# EAGLE design Funktionsgenerator Controller (EAGLE 9.0.0)
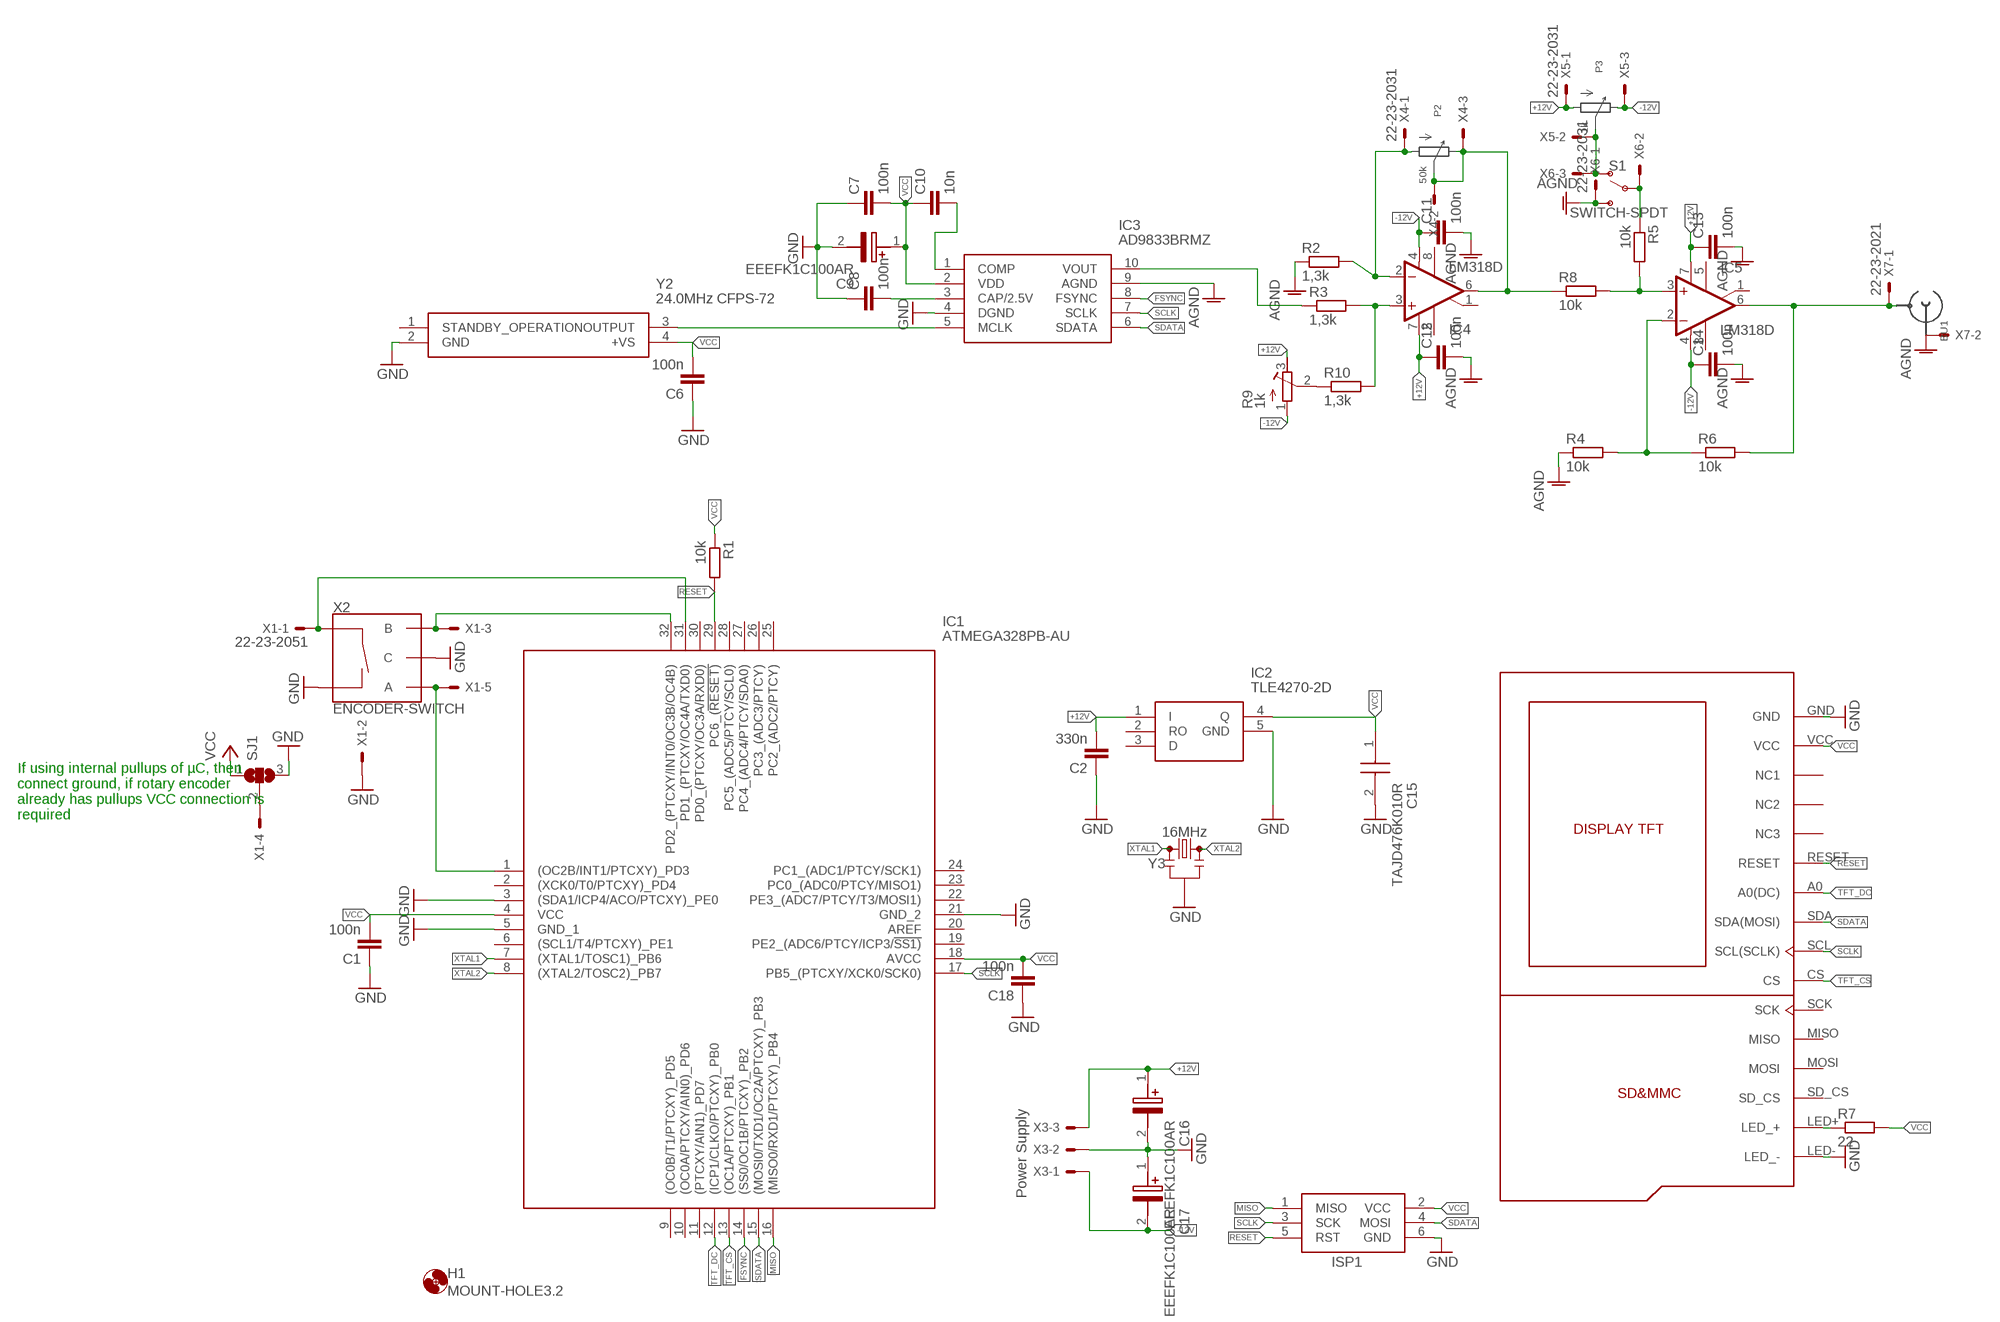
[diagram p0: schematic, sheet 1]

## Parts
C1  100n  C-EUC0603  [C0603]
C2  330n  C-EUC0603  [C0603]
C6  100n  C-EUC0603  [C0603]
C7  100n  C-EUC0603  [C0603]
C8  100n  C-EUC0603  [C0603]
C9  EEEFK1C100AR  [FKV(B)]
C10  10n  C-EUC0603  [C0603]
C11  100n  C-EUC0603  [C0603]
C12  100n  C-EUC0603  [C0603]
C13  100n  C-EUC0603  [C0603]
C14  100n  C-EUC0603  [C0603]
C15  TAJD476K010R  [CAPPM7344X310N]
C16  EEEFK1C100AR  [FKV(B)]
C17  EEEFK1C100AR  [FKV(B)]
C18  100n  C-EUC0603  [C0603]
H1  MOUNT-HOLE3.2  [3,2]
IC1  ATMEGA328PB-AU  [QFP80P900X900X120-32N]
IC2  TLE4270-2D  [PG-TO252-5-11]
IC3  AD9833BRMZ  [SOP50P490X110-10N]
IC4  LM318D  [SO08]
IC5  LM318D  [SO08]
ISP1  AVRISP-6  [AVRISP]
P1  DISPLAY_TFT_1,8  [DISPLAY_TFT_1,8-KMR]
R1  10k  R-EU_R0603  [R0603]
R2  1,3k  R-EU_R0603  [R0603]
R3  1,3k  R-EU_R0603  [R0603]
R4  10k  R-EU_R0603  [R0603]
R5  10k  R-EU_R0603  [R0603]
R6  10k  R-EU_R0603  [R0603]
R7  22  R-EU_R0603  [R0603]
R8  10k  R-EU_R0603  [R0603]
R9  1k  EVM3ESX50B  [EVM3ESX50B]
R10  1,3k  R-EU_R0603  [R0603]
S1  SWITCH-SPDT  (no package)
SJ1  SJ2W  [SJ_2]
X1  22-23-2051  [22-23-2051]
X2  ENCODER-SWITCH  (no package)
X3  Power Supply  22-23-2031  [22-23-2031]
X4  22-23-2031  [22-23-2031]
X5  22-23-2031  [22-23-2031]
X6  22-23-2031  [22-23-2031]
X7  22-23-2021  [22-23-2021]
Y2  24.0MHz CFPS-72  4.0MHZ_CFPS-72_50PPM_-40+85C_5  [CFPS-72]
Y3  16MHz  RESONATOR-16MHZSMD_3.2X1.3  [RESONATOR-SMD-3.2X1.3]

## Nets
+12V: C2.2 C12.1 C13.1 C16.1(+) IC2.1(I) IC4.7(V+) IC5.7(V+) R9.3(E) X3.3 X5.1
-12V: C11.1 C14.1 C17.2(-) IC4.4(V-) IC5.4(V-) R9.1(A) X3.1 X5.3
AGND: C11.2 C12.2 C13.2 C14.2 IC3.9(AGND) R2.1 R4.1 S1.S X6.1 X7.2
FSYNC: IC1.14((SS0/OC1B/PTCXY)_PB2) IC3.8(FSYNC)
GND: C1.1 C2.1 C6.1 C7.1 C8.1 C9.2(-) C15.2(-) C16.2(-) C17.1(+) C18.1 IC1.3((SDA1/ICP4/ACO/PTCXY)_PE0) IC1.5(GND_1) IC1.21(GND_2) IC2.5(GND) IC3.4(DGND) ISP1.6(GND) P1.GND P1.LED-(LED_-) SJ1.3 X1.2 X2.C X2.SW- X3.2 Y2.2(GND) Y3.2
MISO: IC1.16((MISO0/RXD1/PTCXY)_PB4) ISP1.1(MISO)
N$1: IC3.5(MCLK) Y2.3(OUTPUT)
N$2: C8.2 IC3.3(CAP/2.5V)
N$3: IC4.3(+IN) R3.2 R10.2
N$4: C10.2 IC3.1(COMP)
N$5: IC3.10(VOUT) R3.1
N$6: IC4.2(-IN) R2.2 X4.1
N$7: R5.1 S1.P X6.2
N$8: S1.O X5.2 X6.3
N$9: IC4.6(OUT) R8.1 X4.2 X4.3
N$10: IC5.6(OUT) R6.2 X7.1
N$11: IC5.2(-IN) R4.2 R6.1
N$12: SJ1.2 X1.4
N$13: IC5.3(+IN) R5.2 R8.2
N$14: R9.2(S) R10.1
N$18: P1.LED+(LED_+) R7.1
RESET: IC1.29(PC6_(!RESET)) ISP1.5(RST) P1.RESET R1.2
ROT_A: IC1.1((OC2B/INT1/PTCXY)_PD3) X1.5 X2.A
ROT_B: IC1.32(PD2_(PTCXY/INT0/OC3B/OC4B)) X1.3 X2.B
ROT_BTN: IC1.31(PD1_(PTCXY/OC4A/TXD0)) X1.1 X2.SW+
SCLK: IC1.17(PB5_(PTCXY/XCK0/SCK0)) IC3.7(SCLK) ISP1.3(SCK) P1.SCL(SCL(SCLK))
SDATA: IC1.15((MOSI0/TXD1/OC2A/PTCXY)_PB3) IC3.6(SDATA) ISP1.4(MOSI) P1.SDA(SDA(MOSI))
TFT_CS: IC1.13((OC1A/PTCXY)_PB1) P1.CS
TFT_DC: IC1.12((ICP1/CLKO/PTCXY)_PB0) P1.A0(A0(DC))
VCC: C1.2 C6.2 C7.2 C9.1(+) C10.1 C15.1(+) C18.2 IC1.4(VCC) IC1.18(AVCC) IC2.4(Q) IC3.2(VDD) ISP1.2(VCC) P1.VCC R1.1 R7.2 SJ1.1 Y2.4(+VS)
XTAL1: IC1.7((XTAL1/TOSC1)_PB6) Y3.1
XTAL2: IC1.8((XTAL2/TOSC2)_PB7) Y3.3
Unconnected: IC1.2((XCK0/T0/PTCXY)_PD4) IC1.6((SCL1/T4/PTCXY)_PE1) IC1.9((OC0B/T1/PTCXY)_PD5) IC1.10((OC0A/PTCXY/AIN0)_PD6) IC1.11((PTCXY/AIN1)_PD7) IC1.19(PE2_(ADC6/PTCY/ICP3/!SS1)) IC1.20(AREF) IC1.22(PE3_(ADC7/PTCY/T3/MOSI1)) IC1.23(PC0_(ADC0/PTCY/MISO1)) IC1.24(PC1_(ADC1/PTCY/SCK1)) IC1.25(PC2_(ADC2/PTCY)) IC1.26(PC3_(ADC3/PTCY)) IC1.27(PC4_(ADC4/PTCY/SDA0)) IC1.28(PC5_(ADC5/PTCY/SCL0)) IC1.30(PD0_(PTCXY/OC3A/RXD0)) IC2.2(RO) IC2.3(D) IC4.1(ON/CMP) IC4.5(ON) IC4.8(CMP) IC5.1(ON/CMP) IC5.5(ON) IC5.8(CMP) P1.MISO P1.MOSI P1.NC1 P1.NC2 P1.NC3 P1.SCK P1.SD_CS Y2.1(STANDBY_OPERATION)

## Notes on the sheet
- If using internal pullups of µC, then
  connect ground, if rotary encoder
  already has pullups VCC connection is
  required

## Library data of the parts
C1 C2 C6-C8 C10-C14 C18 = resistor:C-EU: CAPACITOR, European symbol
C9 C16 C17 = SamacSys_Parts:EEEFK1C100AR: Panasonic 10F 20% 1.35 16 V dc SMD Cylindrical Aluminium Electrolytic Capacitor Source: Datasheet <https://industrial.panasonic.com/cdbs/www-data/pdf/RDE0000/ABA0000C1175.pdf>; ALLIED_NUMBER: 70256491; ALLIED_PRICE/STOCK: https://www.alliedelec.com/panasonic-eee-fk1c100ar/70256491/; ARROW_PART_NUMBER: EEEFK1C100AR; ARROW_PRICE/STOCK: http://uk.rs-online.com/web/p/products/0565572; DESCRIPTION: Panasonic 10F 20% 1.35 16 V dc SMD Cylindrical Aluminium Electrolytic Capacitor; HEIGHT: mm; MANUFACTURER_NAME: Panasonic; MANUFACTURER_PART_NUMBER: EEEFK1C100AR; RS_PART_NUMBER: 0565572; RS_PRICE/STOCK: http://uk.rs-online.com/web/p/products/0565572
C15 = SamacSys_Parts:TAJD476K010R: AVX 47F SMD Solid MnO2 Tantalum Electrolytic Capacitor, 10 V dc 10%, TAJ Series Source: Datasheet <http://www.farnell.com/datasheets/1680476.pdf>; ALLIED_NUMBER: 70475107; ALLIED_PRICE/STOCK: https://www.alliedelec.com/avx-tajd476k010r/70475107/; ARROW_PART_NUMBER: TAJD476K010R; ARROW_PRICE/STOCK: http://uk.rs-online.com/web/p/products/4648224; DESCRIPTION: AVX 47F SMD Solid MnO2 Tantalum Electrolytic Capacitor, 10 V dc 10%, TAJ Series; HEIGHT: 3.1mm; MANUFACTURER_NAME: AVX; MANUFACTURER_PART_NUMBER: TAJD476K010R; RS_PART_NUMBER: 4648224; RS_PRICE/STOCK: http://uk.rs-online.com/web/p/products/4648224
H1 = holes:MOUNT-HOLE: MOUNTING HOLE with drill center marker
IC1 = SamacSys_Parts:ATMEGA328PB-AU: ATMEL - ATMEGA328PB-AU - MCU, 8BIT, ATMEGA, 20MHZ, TQFP-32 Source: Datasheet <http://www.farnell.com/datasheets/2014286.pdf>; ARROW_PART_NUMBER: ATMEGA328PB-AU; ARROW_PRICE/STOCK: https://www.arrow.com/en/products/atmega328pb-au/microchip-technology; DESCRIPTION: ATMEL - ATMEGA328PB-AU - MCU, 8BIT, ATMEGA, 20MHZ, TQFP-32; HEIGHT: 1.2mm; MANUFACTURER_NAME: Microchip; MANUFACTURER_PART_NUMBER: ATMEGA328PB-AU; RS_PART_NUMBER: 1463221; RS_PRICE/STOCK: http://uk.rs-online.com/web/p/products/1463221
IC2 = SamacSys_Parts:TLE4270-2D: Infineon TLE4270-2D, LDO Voltage Regulator, 850mA, 5 V 2%, 6 42 Vin, 4-Pin TO-252 Source: Datasheet <http://www.infineon.com/dgdl/Infineon-TLE4270_2-DS-v01_08-en.pdf?fileId=db3a3043163797a601163915ad4d01c9&sd=t>; ARROW_PART_NUMBER: TLE4270-2D; ARROW_PRICE/STOCK: http://uk.rs-online.com/web/p/products/1109087P; DESCRIPTION: Infineon TLE4270-2D, LDO Voltage Regulator, 850mA, 5 V 2%, 6 42 Vin, 4-Pin TO-252; HEIGHT: mm; MANUFACTURER_NAME: Infineon; MANUFACTURER_PART_NUMBER: TLE4270-2D; RS_PART_NUMBER: 1109087P; RS_PRICE/STOCK: http://uk.rs-online.com/web/p/products/1109087P
IC3 = SamacSys_Parts:AD9833BRMZ: Data Acquisition ADCs/DACs - Specialized 12.65mW 2.3-5.5V Prog Waveform Gen Source: Datasheet <https://componentsearchengine.com/Datasheets/1/AD9833BRMZ.pdf>; ARROW_PART_NUMBER: AD9833BRMZ; ARROW_PRICE/STOCK: https://www.arrow.com/en/products/ad9833brmz/analog-devices; DESCRIPTION: Data Acquisition ADCs/DACs - Specialized 12.65mW 2.3-5.5V Prog Waveform Gen; HEIGHT: 1.1mm; MANUFACTURER_NAME: Analog Devices; MANUFACTURER_PART_NUMBER: AD9833BRMZ; RS_PART_NUMBER: 5236428; RS_PRICE/STOCK: http://uk.rs-online.com/web/p/products/5236428
IC4 IC5 = linear:LM318: OP AMP
ISP1 = adafruit:AVRISP: AVR ISP HEADER Standard 6 pin header for AVR programming
P1 = display-TFT-1.8-KMR:DISPLAY_TFT_1,8
R1-R8 R10 = resistor:R-EU_: RESISTOR, European symbol
R9 = user:EVM3ESX50B; SPICEPREFIX: J
S1 = Symbols-Not-On-Board:SWITCH-SPDT
SJ1 = jumper:SJ2W: SMD solder JUMPER
X1 = con-molex:22-23-2051: .100" (2.54mm) Center Header - 5 Pin; MF: MOLEX; MPN: 22-23-2051; OC_FARNELL: 1462952; OC_NEWARK: 38C9178
X2 = Symbols-Not-On-Board:ENCODER-SWITCH
X3-X6 = con-molex:22-23-2031: .100" (2.54mm) Center Header - 3 Pin; MF: MOLEX; MPN: 22-23-2031; OC_FARNELL: 1462950; OC_NEWARK: 30C0862
X7 = con-molex:22-23-2021: .100" (2.54mm) Center Header - 2 Pin; MF: MOLEX; MPN: 22-23-2021; OC_FARNELL: 1462926; OC_NEWARK: 25C3832
Y2 = SamacSys_Parts:4.0MHZ_CFPS-72_50PPM_-40+85C_5: 4.0MHz CFPS-72 XO SMD 7x5mm 50ppm 5V 4.0MHz CFPS-72 50ppm -40+85C 5V, Crystal Oscillator, 4 MHz, 50ppm HCMOS, TTL 50pF, 4-Pin SMD, 7.2 x 5.2 x 1.4mm Source: Datasheet <https://docs-emea.rs-online.com/webdocs/151a/0900766b8151ac33.pdf>; ARROW_PART_NUMBER: 4.0MHz CFPS-72 50ppm -40+85C 5V; ARROW_PRICE/STOCK: http://uk.rs-online.com/web/p/products/8141584; DESCRIPTION: 4.0MHz CFPS-72 XO SMD 7x5mm 50ppm 5V 4.0MHz CFPS-72 50ppm -40+85C 5V, Crystal Oscillator, 4 MHz, 50ppm HCMOS, TTL 50pF, 4-Pin SMD, 7.2 x 5.2 x 1.4mm; HEIGHT: mm; MANUFACTURER_NAME: IQD; MANUFACTURER_PART_NUMBER: 4.0MHz CFPS-72 50ppm -40+85C 5V; RS_PART_NUMBER: 8141584; RS_PRICE/STOCK: http://uk.rs-online.com/web/p/products/8141584
Y3 = SparkFun-Clocks:RESONATOR-16MHZ: 16MHz Resonator Digikey Example <http://www.digikey.com/product-detail/en/murata-electronics-north-america/CSTCE16M0V53-R0/490-1198-1-ND/584635> Frequency: 16MHz Frequency Stability: ±0.3% Frequency Tolerance: ±0.5% Capacitance: 15pF SparkFun Products SparkFun OpenLog <https://www.sparkfun.com/products/13712> SparkFun MicroView - OLED Arduino Module <https://www.sparkfun.com/products/12923>; PROD_ID: XTAL-08900

## Board
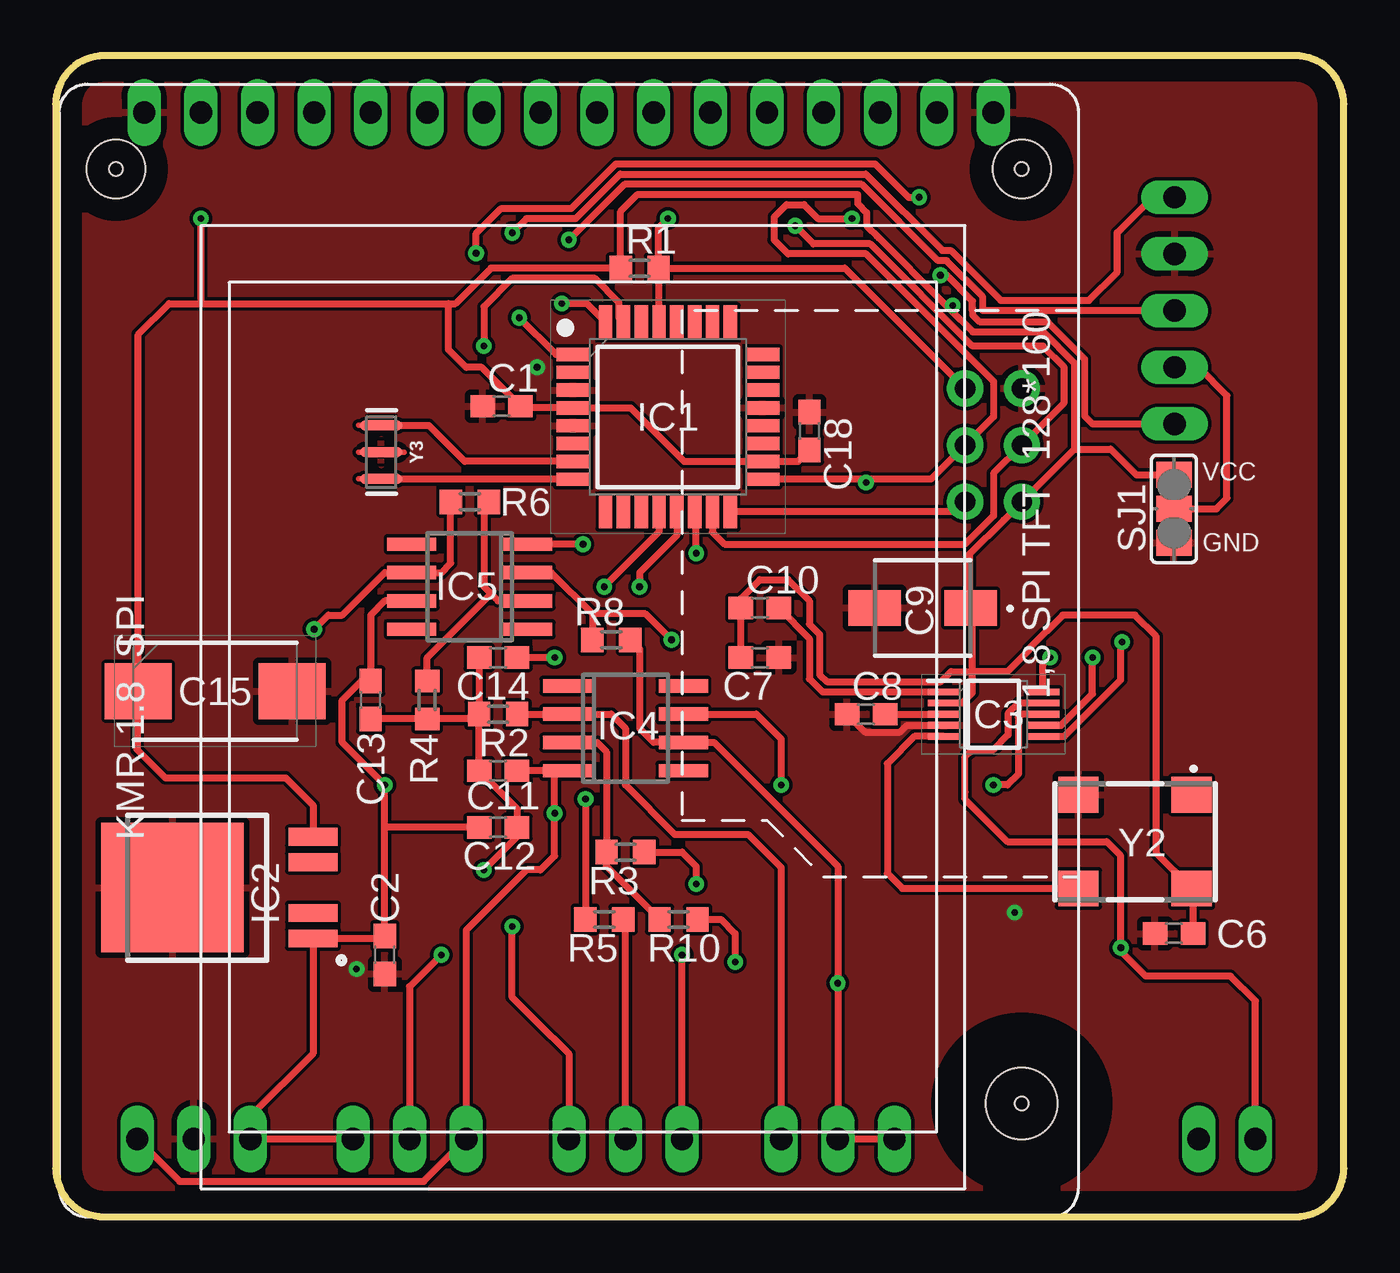
[diagram p1: board, top side]
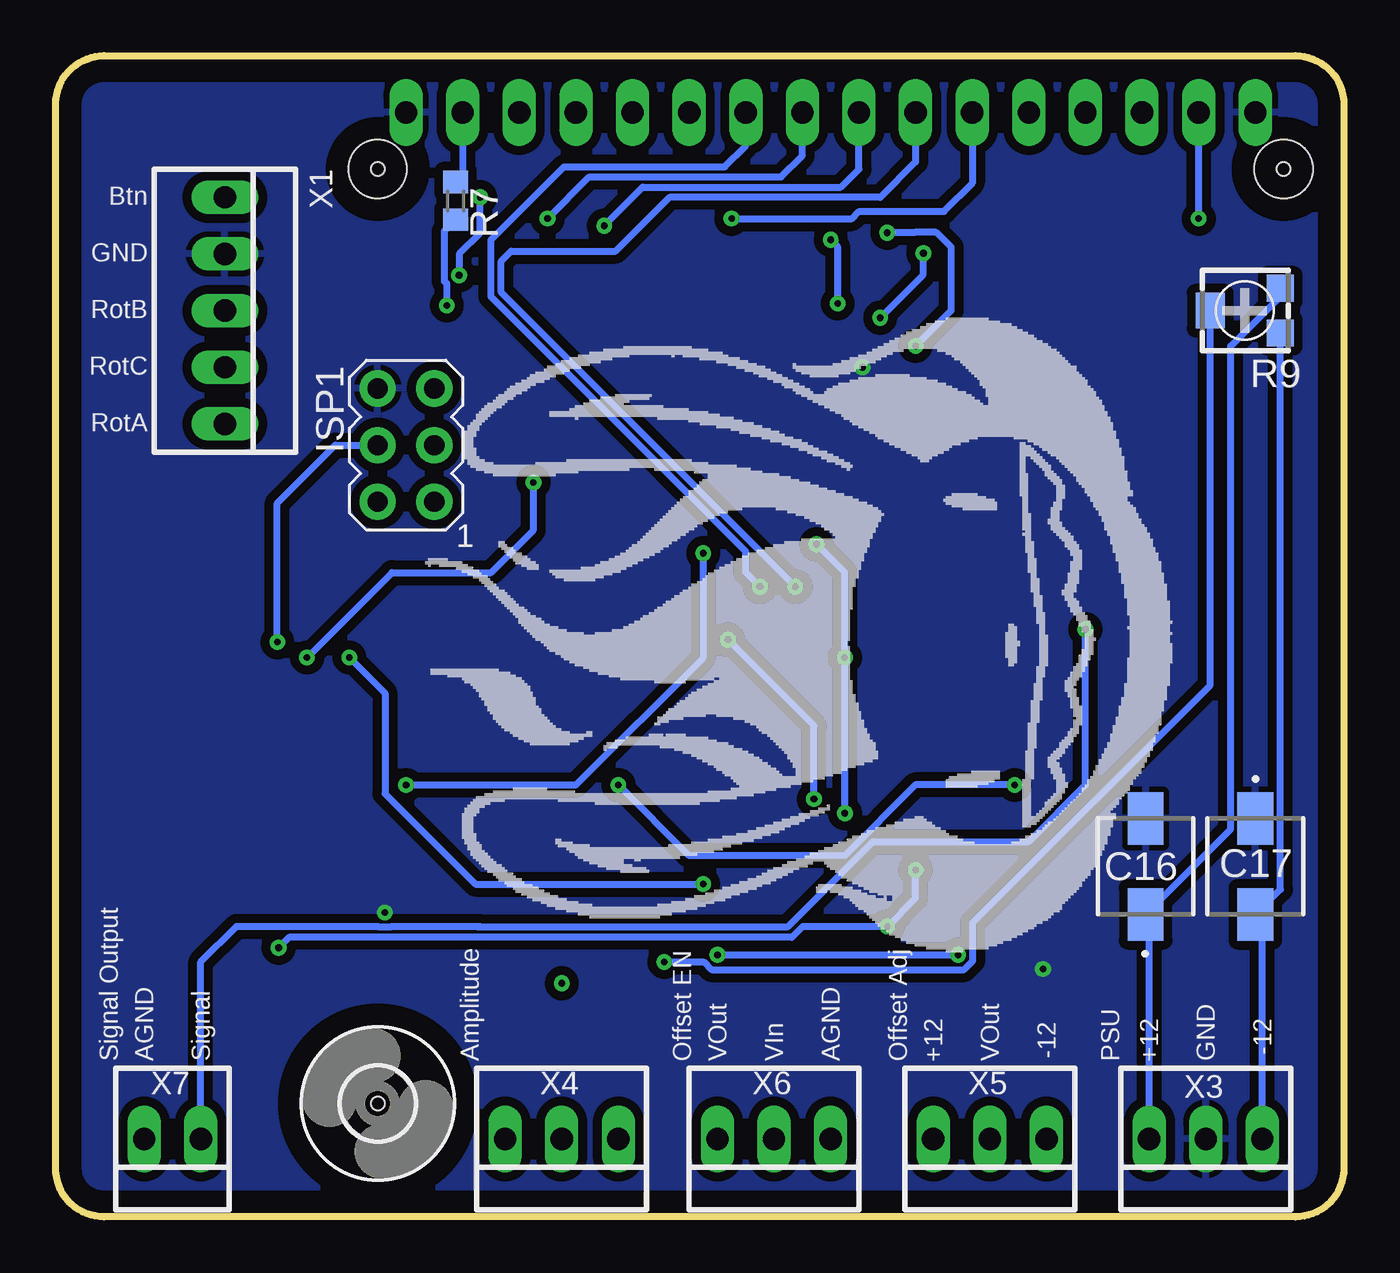
[diagram p2: board, bottom side, seen from below]

Size 57.78 x 52.07 mm. Coordinates in mm from the lower left corner, seen from the top.
Outline: 2.17,0 55.62,0 arc90 57.78,2.17 57.78,49.9 arc90 55.62,52.07 2.17,52.07 arc90 0,49.9 0,2.17 arc90 2.17,0
Copper layers (1*16): Top 0.035mm / dielectric 1.5mm / Bottom 0.035mm
Design rules "default": minimum track width 6mil, minimum drill 0.35mm, track to track 6mil, track to pad 6mil, pad to pad 6mil, via to via 6mil, smd to smd 6mil, copper to edge 40mil, drill to drill 6mil, minimum pad ring 10mil, minimum via ring 8mil, stop-mask expansion 4mil, vias tented up to drill 0mil, thermal gap 10mil
Holes 2.6 mm at 43.34,46.99 2.7,46.99

### Footprints (pad centres in the part's own frame; a part is rotated, then mirrored left to right if it is on the bottom)
C0603 = smd 1.1 x 1: 1 -0.85,0; 2 0.85,0
FKV(B) = smd 2.35 x 1.6: 1 -2.15,0; 2 2.15,0
CAPPM7344X310N = smd 3 x 2.5: 1 -3.45,0; 2 3.45,0
3,2 = hole 3.2: 0,0
QFP80P900X900X120-32N = smd 1.5 x 0.6: 1 -4.25,2.8; 2 -4.25,2; 3 -4.25,1.2; 4 -4.25,0.4; 5 -4.25,-0.4; 6 -4.25,-1.2; 7 -4.25,-2; 8 -4.25,-2.8; 17 4.25,-2.8; 18 4.25,-2; 19 4.25,-1.2; 20 4.25,-0.4; 21 4.25,0.4; 22 4.25,1.2; 23 4.25,2; 24 4.25,2.8 | smd 0.6 x 1.5: 9 -2.8,-4.25; 10 -2,-4.25; 11 -1.2,-4.25; 12 -0.4,-4.25; 13 0.4,-4.25; 14 1.2,-4.25; 15 2,-4.25; 16 2.8,-4.25; 25 2.8,4.25; 26 2,4.25; 27 1.2,4.25; 28 0.4,4.25; 29 -0.4,4.25; 30 -1.2,4.25; 31 -2,4.25; 32 -2.8,4.25
PG-TO252-5-11 = smd 0.8 x 2.2: 1 -2.28,-6.3; 2 -1.14,-6.3; 3 1.14,-6.3; 4 2.28,-6.3 | smd 5.8 x 6.4: 5 0,0
SOP50P490X110-10N = smd 1.45 x 0.3: 1 -2.225,1; 2 -2.225,0.5; 3 -2.225,0; 4 -2.225,-0.5; 5 -2.225,-1; 6 2.225,-1; 7 2.225,-0.5; 8 2.225,0; 9 2.225,0.5; 10 2.225,1
SO08 = smd 0.6 x 2.2: 1 -1.905,-2.6; 2 -0.635,-2.6; 3 0.635,-2.6; 4 1.905,-2.6; 5 1.905,2.6; 6 0.635,2.6; 7 -0.635,2.6; 8 -1.905,2.6
AVRISP = drill 0.9 pad 1.626: 1 -1.27,2.54; 2 1.27,2.54; 3 -1.27,0; 4 1.27,0; 5 -1.27,-2.54; 6 1.27,-2.54
DISPLAY_TFT_1,8-KMR = drill 1 long: A0 -25.4,-3.81; CS -25.4,3.81; GND -25.4,-19.05; LED+ -25.4,16.51; LED- -25.4,19.05; MISO -25.4,8.89; MOSI -25.4,11.43; NC1 -25.4,-13.97; NC2 -25.4,-11.43; NC3 -25.4,-8.89; RESET -25.4,-6.35; SCK -25.4,6.35; SCL -25.4,1.27; SD_CS -25.4,13.97; SDA -25.4,-1.27; VCC -25.4,-16.51 | hole 0.6: -22.86,-20.32; -22.86,20.32; 19.05,20.32
R0603 = smd 1 x 1.1: 1 -0.85,0; 2 0.85,0
EVM3ESX50B = smd 1.2 x 1.2: 1 -1,-1.6; 3 1,-1.6 | smd 1.6 x 1.3: 2 0,1.55
SJ_2 = smd 1.168 x 1.6: 1 -1.524,0; 2 0,0; 3 1.524,0
22-23-2051 = drill 1 long: 1 -5.08,0; 2 -2.54,0; 3 0,0; 4 2.54,0; 5 5.08,0
22-23-2031 = drill 1 long: 1 -2.54,0; 2 0,0; 3 2.54,0
22-23-2021 = drill 1 long: 1 -1.27,0; 2 1.27,0
CFPS-72 = smd 1.8 x 1.6: 1 -2.54,-2.1; 2 2.54,-2.1; 3 2.54,2.1; 4 -2.54,2.1
RESONATOR-SMD-3.2X1.3 = smd 0.45 x 1.905: 1 -1.2,0; 2 0,0; 3 1.2,0

### Placement (x,y rotation side)
C1  20,36.35 0 top
C2  14.76,11.75 90 top
C6  50.16,12.7 0 top
C7  31.59,25.08 180 top
C8  36.35,22.54 0 top
C9  38.89,27.3 180 top
C10  31.59,27.3 0 top
C11  19.84,20 180 top
C12  19.84,17.46 0 top
C13  14.13,23.18 270 top
C14  19.84,25.08 180 top
C15  7.15,23.57 0 top
C16  8.89,15.72 90 bottom
C17  3.97,15.72 270 bottom
C18  33.81,35.24 270 top
H1  43.34,5.08 90 bottom
IC1  27.46,35.88 0 top
IC2  5.24,14.76 90 top
IC3  42.07,22.54 0 top
IC4  25.56,21.91 270 top
IC5  18.57,28.26 90 top
ISP1  42.07,34.61 180 bottom
P1  23.02,24.13 270 top
R1  26.19,42.55 0 top
R2  19.84,22.54 0 top
R3  25.56,16.35 180 top
R4  16.67,23.18 90 top
R5  24.61,13.34 180 top
R6  18.57,32.07 180 top
R7  39.85,45.56 270 bottom
R8  24.92,25.88 180 top
R9  4.45,40.64 90 bottom
R10  27.94,13.34 180 top
SJ1  50.16,31.75 270 top
X1  50.2,40.64 270 bottom
X3  6.19,3.49 180 bottom
X4  35.08,3.49 180 bottom
X5  15.88,3.49 180 bottom
X6  25.56,3.49 180 bottom
X7  52.55,3.49 180 bottom
Y2  48.42,16.83 180 top
Y3  14.61,34.29 270 top

### Tracks (layer width: path | path; a pad name or v marks a point on that pad's centre or on a via)
+12V  (via drill 0.3)
  Top 0.305: IC5.7 14.76,27.62 14.13,26.99 C13.1 13.71,24.03 12.86,23.18 12.86,21.27 v14.76,19.37 14.76,17.46 | 14.76,17.46 C2.2 14.65,12.48 IC2.1 11.54,7.32 8.73,4.51 X3.3 X5.1 | C12.1 14.76,17.46 | v32.54,19.37 32.54,21.43 31.43,22.54 IC4.7
  Bottom 0.305: v14.76,19.37 19.22,19.37 22.39,16.2 29.38,16.2 v32.54,19.37 | X3.3 8.73,13.41 8.77,13.45 C16.1 5.07,17.38 5.07,39.04 2.85,41.27 R9.3
-12V  (via drill 0.3)
  Top 0.305: IC4.4 22.38,20 | 22.38,20 C11.1 | 22.38,20 v22.38,18.1 22.38,16.19 21.75,15.56 21.11,15.56 18.41,12.86 X5.3 16.51,1.59 5.56,1.59 X3.1 | v22.38,25.08 C14.1 | v23.65,30.16 IC5.4
  Bottom 0.305: v22.38,18.1 v22.38,25.08 22.38,28.89 v23.65,30.16 | X3.1 3.65,13.25 C17.2 2.85,14.69 R9.1
AGND  (via drill 0.3)
  Top 0.305: R2.1 18.78,22.33 R4.1 C13.2 | R2.1 C11.2 20.69,18.3 C12.2 20.69,17.04 v19.21,15.56 | 21.75,8.57 21.51,8.81 | 21.51,8.81 20.48,9.84 v20.48,13.02 | C14.2 R2.1 | IC3.9 43.19,23.04 42.72,22.57 42.72,21.61 42.07,20.95 41.12,20.95 40.8,20.64 40.8,19.05 40.8,18.73 42.7,16.83 47.15,16.83 47.78,16.19 v47.78,12.06 47.78,11.91 48.9,10.79 52.7,10.79 53.82,9.68 X7.2 | 21.51,8.81 23.02,7.3 X6.1
  Bottom 0.305: v19.21,15.56 19.21,14.29 v20.48,13.02 24.28,13.02 24.76,12.54 47.31,12.54 v47.78,12.06
FSYNC  (via drill 0.3)
  Top 0.305: v28.73,29.76 28.73,31.56 IC1.14 | IC3.8 43.34,22.54 43.18,22.38 43.18,19.84 42.7,19.37 v42.07,19.37
  Bottom 0.305: v42.07,19.37 34.45,19.37 28.73,25.08 v28.73,29.76
GND  (via drill 0.3)
  Top 0.305: IC3.4 38.19,22.04 37.88,21.74 36.31,21.74 C8.1 | 31.8,36.2 IC1.21
  other vias: 13.49,11.11 43.02,13.65 21.59,38.1
  pour Bottom (isolate 0.406): 0,2.17 0,49.9 arc-90 2.17,52.07 55.62,52.07 arc-90 57.78,49.9 57.78,2.17 arc-90 55.62,0 2.17,0 arc-90
  pour Top: 2.17,0 55.62,0 arc90 57.78,2.17 57.78,49.9 arc90 55.62,52.07 2.17,52.07 arc90 0,49.9 0,2.17 arc90
MISO
  Top 0.305: IC1.16 40.36,31.63 ISP1.1
N$1
  Top 0.305: IC3.5 38.53,21.54 37.31,20.32 37.31,15.4 37.98,14.73 38.73,14.73 Y2.3
N$2
  Top 0.305: C8.2 IC3.3
N$3
  Top 0.305: IC4.3 24.29,21.27 24.71,20.85 24.71,16.51 | 24.71,16.51 R3.2 | R10.2 24.71,15.72 24.71,16.51
N$4
  Top 0.305: C10.2 33.81,25.93 33.81,24.13 34.4,23.54 IC3.1
N$5  (via drill 0.3)
  Top 0.305: IC3.10 44.29,24.77 v44.61,25.08 | 26.46,16.3 R3.1 28.1,16.35 28.73,15.72 v28.73,14.92
  Bottom 0.305: v44.61,25.08 43.01,23.48 43.01,18.98 39.32,15.29 38.96,14.92 v28.73,14.92
N$6
  Top 0.305: R2.2 IC4.2 24.92,22.54 25.56,21.91 25.56,19.37 27.77,17.16 31.05,17.16 32.54,15.67 X4.1
N$7
  Top 0.305: X6.2 25.56,13.23 R5.1
N$8  (via drill 0.3)
  Top 0.305: X6.3 v28.1,11.75 | X5.2 15.88,10.32 v17.3,11.75
  Bottom 0.305: v28.1,11.75 v17.3,11.75
N$9  (via drill 0.3)
  Top 0.305: X4.3 X4.2 v35.08,10.48 35.08,15.72 29.53,21.27 IC4.6 26.83,21.27 26.19,21.91 26.19,24.92 26.19,25.08 26.19,25.46 R8.1
N$10  (via drill 0.3)
  Top 0.305: R6.2 17.72,29.31 17.3,28.89 IC5.6 14.76,28.89 12.86,26.99 12.22,26.99 v11.59,26.35
  Bottom 0.305: 38.89,13.02 38.73,13.02 | 38.73,13.02 24.92,13.02 21.11,16.83 14.13,16.83 11.59,19.37 v11.59,26.35 | 38.73,13.02 42.73,13.02 42.75,12.99 43.29,12.99 43.32,13.02 49.69,13.02 51.28,11.43 X7.1
N$11
  Top 0.305: R6.1 19.21,31.85 19.21,28.26 19.53,27.94 | 19.53,27.94 19.84,27.62 IC5.2 | R4.2 16.67,25.08 19.53,27.94
N$12
  Top 0.305: SJ1.2 52.07,31.75 52.55,32.23 52.55,36.83 51.28,38.1 X1.4
N$13  (via drill 0.3)
  Top 0.305: IC5.3 22.23,28.89 24.07,27.04 | 24.07,27.04 R8.2 | v27.62,25.88 26.45,27.04 24.07,27.04 | v23.77,18.73 R5.2
  Bottom 0.305: v23.77,18.73 23.77,22.02 v27.62,25.88
N$14  (via drill 0.3)
  Top 0.305: R10.1 29.84,13.34 30.48,12.7 v30.48,11.43
  Bottom 0.305: R9.2 6,23.85 16.38,13.46 | 16.51,13.34 16.38,13.46 | v30.48,11.43 28.71,11.43 28.37,11.09 17.03,11.09 16.65,11.47 16.65,13.2 16.38,13.46
N$16
  pour Bottom: 58.13,35.05 58.2,35.12 58.2,45.34 58.13,45.4
N$18
  Bottom 0.305: P1.LED+ 39.53,46.73 R7.1
RESET  (via drill 0.3)
  Top 0.305: 27.15,42.55 35.4,42.55 ISP1.5 | 27.15,42.55 R1.2 27.04,44.35 v27.46,44.77 | IC1.29 27.06,42.46 27.15,42.55
  Bottom 0.305: v27.46,44.77 22.07,44.77 21.75,45.09 17.94,45.09 16.67,46.35 P1.RESET
ROT_A  (via drill 0.3)
  Top 0.305: IC1.1 22.44,38.68 v20.8,40.32 | v18.86,43.21 18.86,44.1 19.98,45.23 23.14,45.23 25.13,47.22 36.76,47.22 38.26,45.72 v38.73,45.72 | X1.5 46.51,35.56 46.16,35.92 46.16,38.48 44.49,40.15 41.44,40.15 41.13,40.45 41.13,40.64 | 41.13,40.78 41.13,40.64 | 41.13,40.64 41.13,41.06 39.97,42.23 v39.69,42.23
  Bottom 0.305: v20.8,40.32 18.86,42.26 v18.86,43.21 | v38.73,45.72 38.78,45.67 38.78,44.09 39.69,43.18 v39.69,42.23
ROT_B  (via drill 0.3)
  Top 0.305: IC1.32 23.83,40.96 v22.7,40.96 | v23.02,43.81 25.51,46.31 36.16,46.31 39.58,42.89 39.96,42.89 41.59,41.25 41.59,40.64 X1.3
  Bottom 0.305: v22.7,40.96 22.7,43.5 v23.02,43.81
ROT_BTN  (via drill 0.3)
  Top 0.305: IC1.31 25.27,40.32 25.27,41 24.18,42.09 20.48,42.09 19.21,40.82 v19.21,39.05 | v20.48,44.13 21.11,44.77 23.32,44.77 25.32,46.76 36.35,46.76 39.77,43.34 40.15,43.34 42.4,41.1 46.35,41.1 47.62,42.37 47.62,44.13 49.21,45.72 X1.1
  Bottom 0.305: v20.48,44.13 19.27,44.13 19.25,44.15 18.28,44.15 17.62,43.5 17.62,40.64 v19.21,39.05
SCLK  (via drill 0.3)
  Top 0.305: 36.35,33.08 39.27,33.08 ISP1.3 42.07,35.88 42.07,37.47 36.35,43.18 32.86,43.18 32.23,43.81 32.24,43.83 32.24,44.84 32.79,45.39 33.57,45.39 34.19,44.77 v35.72,44.77 | 36.35,33.08 IC1.17 | v46.51,25.08 46.51,23.46 45.1,22.04 IC3.7 | v36.35,32.94 36.35,33.08
  Bottom 0.305: v46.51,25.08 42.7,28.89 38.26,28.89 36.35,30.8 v36.35,32.94 | v35.72,44.77 33.85,46.63 25.24,46.63 24.29,47.59 P1.SCL
SDATA  (via drill 0.3)
  Top 0.305: IC1.15 29.46,30.7 30,30.16 40.8,30.16 42.07,31.43 42.07,33.34 ISP1.4 45.24,36.51 45.24,38.1 44.29,39.05 41.13,39.05 36.54,43.64 33.99,43.64 v33.18,44.45 | v47.84,25.77 47.78,25.72 47.78,24.08 45.25,21.54 IC3.6
  Bottom 0.305: v47.84,25.77 47.84,32.01 45.24,34.61 ISP1.4 | v33.18,44.45 31.45,46.18 22.56,46.18 21.75,46.99 P1.SDA
TFT_CS  (via drill 0.3)
  Top 0.305: IC1.13 27.86,30.56 26.19,28.89 v26.19,28.26
  Bottom 0.305: v26.19,28.26 26.83,28.89 26.83,29.83 38.26,41.26 38.26,43.81 34.98,47.09 27.78,47.09 26.83,48.04 P1.CS
TFT_DC  (via drill 0.3)
  Top 0.305: IC1.12 27.06,30.71 v24.61,28.26
  Bottom 0.305: P1.A0 19.21,47.31 20.8,45.72 30.26,45.72 32.67,43.31 37.36,43.31 37.8,42.86 37.8,41.45 v24.61,28.26
VCC  (via drill 0.3)
  Top 0.305: 50.98,14.71 Y2.4 | 42.53,31.25 42.53,31.24 | 40.99,29.7 40.98,29.7 | 42.53,31.24 40.99,29.7 | 6.51,40.96 17.62,40.96 | 17.62,40.96 17.94,40.96 19.53,42.55 R1.1 25.34,45.09 26.11,45.85 35.97,45.85 35.97,45.45 36.38,45.04 36.38,44.45 36.92,43.91 | 40.99,29.7 40.99,27.36 C9.1 | 41.04,26.91 C9.1 | IC3.2 40.66,23.04 41.12,23.5 41.12,24.45 | v6.51,44.77 6.51,40.96 | 45.7,34.43 45.7,38.29 44.3,39.69 41.14,39.69 40.1,40.73 | C9.1 41.12,27.23 41.12,24.45 | 41.12,24.45 40.16,24.45 39.72,24 34.59,24 34.27,24.32 34.27,26.12 33.81,26.58 33.81,27.62 32.86,28.57 31.59,28.57 30.74,27.73 C10.1 C7.2 | 41.12,24.45 42.7,24.45 43.67,25.41 43.67,25.47 45.18,26.99 48.42,26.99 49.37,26.04 49.37,16.32 Y2.4 | 45.7,34.43 47.33,34.43 48.48,33.27 SJ1.1 | Y2.4 51.02,14.67 C6.2 | 6.51,40.96 5.08,40.96 3.7,39.58 C15.1 3.65,23.52 3.65,20.95 4.92,19.68 10.32,19.68 11.54,18.46 IC2.4 | 42.53,31.24 43.34,32.06 | 43.34,32.06 ISP1.2 | 45.7,34.43 ISP1.2 | ISP1.2 43.34,32.06 | 36.83,44 36.92,43.91 | 36.92,43.91 39.78,41.05 40.1,40.73 | 40.1,40.73 v40.24,40.87 | C18.2 33.3,33.88 IC1.18 28.19,33.88 25.79,36.28 IC1.4 20.93,36.28 C1.2 19.11,38.1 18.41,38.1 17.62,38.89 17.62,40.96
  Bottom 0.305: v6.51,44.77 P1.VCC | v40.24,40.87 40.24,41.85 40.35,41.95 40.35,44.21 R7.2
XTAL1
  Top 0.305: IC1.7 18.35,33.88 16.75,35.48 16.74,35.49 Y3.1 14.68,35.56
XTAL2
  Top 0.305: IC1.8 14.62,33.08 Y3.3

### Text on the board
tNames: VCC | GND
bNames: Btn | GND | RotB | RotC | RotA | -12 | +12 | -12 | +12 | GND | PSU | VOut | Offset Adj | AGND | VIn | VOut | Offset EN | Amplitude | Signal | AGND | Signal Output